# EAGLE design Serial_Adapter (EAGLE 7.5.0)
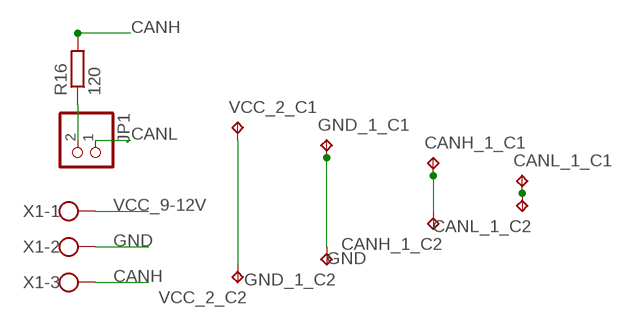
[diagram p0: schematic, sheet 1]

## Parts
CANH_1_C1  TPB2,54  [B2,54]
CANH_1_C2  TPB2,54  [B2,54]
CANL_1_C1  TPB2,54  [B2,54]
CANL_1_C2  TPB2,54  [B2,54]
GND_1_C1  TPB2,54  [B2,54]
GND_1_C2  TPB2,54  [B2,54]
JP1  PINHD-1X2  [1X02]
R16  120  R-EU_R0805  [R0805]
VCC_2_C1  TPB2,54  [B2,54]
VCC_2_C2  TPB2,54  [B2,54]
X1  W237-103  [W237-103]

## Nets
CANH: CANH_1_C1.TP CANH_1_C2.TP R16.2 X1.3
CANL: CANL_1_C1.TP CANL_1_C2.TP JP1.1
GND: GND_1_C1.TP GND_1_C2.TP X1.2
N$1: JP1.2 R16.1
VCC_9-12V: VCC_2_C1.TP VCC_2_C2.TP X1.1

## Library data of the parts
CANH_1_C1 CANH_1_C2 CANL_1_C1 CANL_1_C2 GND_1_C1 GND_1_C2 VCC_2_C1 VCC_2_C2 = testpad:TP: Test pad
JP1 = pinhead:PINHD-1X2: PIN HEADER
R16 = rcl:R-EU_: RESISTOR, European symbol
X1 = con-wago-500:W237-103: WAGO SCREW CLAMP; MPN: 237-103; OC_FARNELL: unknown; OC_NEWARK: 18M7116

## Board
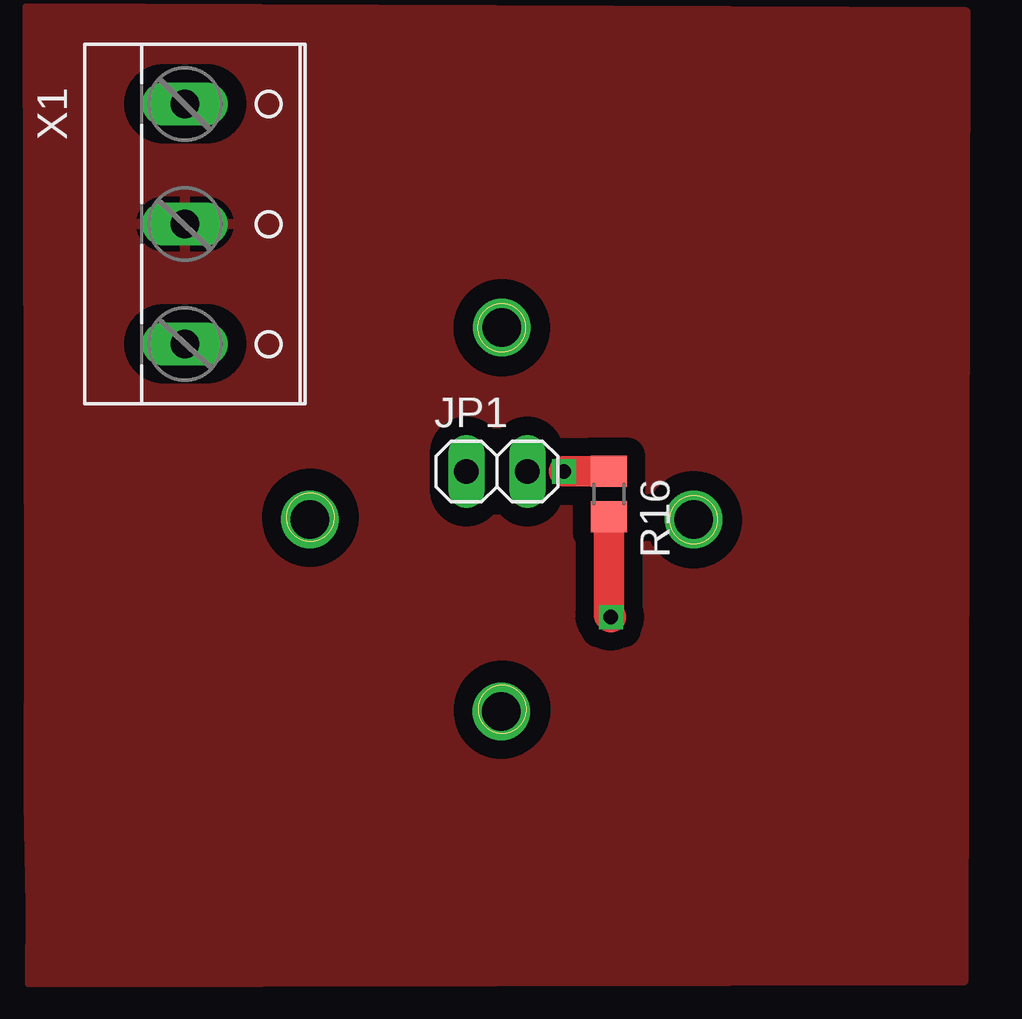
[diagram p1: board, top side]
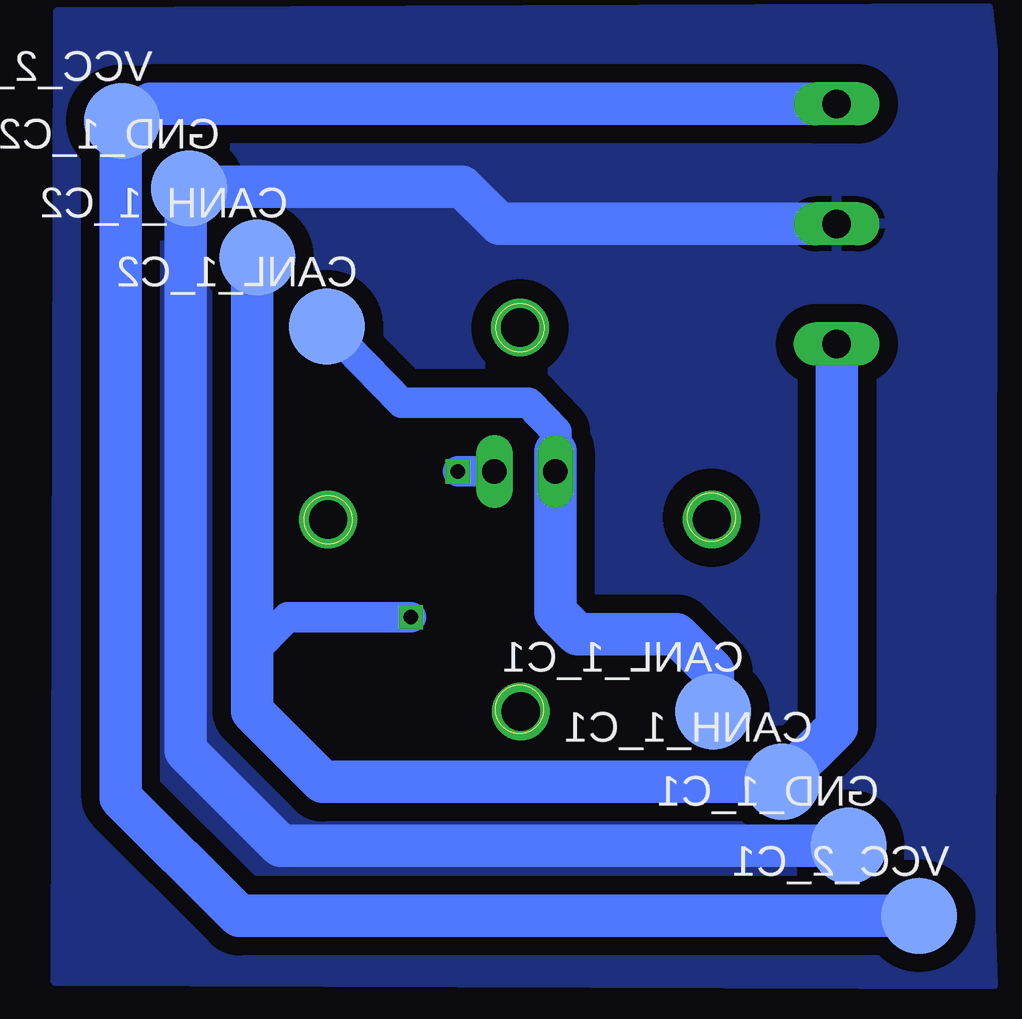
[diagram p2: board, bottom side, seen from below]

Size 17.97 x 17.9 mm. Coordinates in mm from the lower left corner, seen from the top.
Outline: circle at 8.97,16.9 radius 1
Outline: circle at 16.97,8.9 radius 1
Outline: circle at 1,9 radius 1
Outline: circle at 9,1 radius 1
Copper layers (1*16): Top 0.035mm / dielectric 1.5mm / Bottom 0.035mm
Design rules "default": minimum track width 10mil, minimum drill 24mil, track to track 8mil, track to pad 8mil, pad to pad 8mil, via to via 8mil, smd to smd 8mil, copper to edge 40mil, drill to drill 8mil, minimum pad ring 10mil, minimum via ring 8mil, stop-mask expansion 4mil, vias tented up to drill 0mil, thermal gap 10mil

### Footprints (pad centres in the part's own frame; a part is rotated, then mirrored left to right if it is on the bottom)
B2,54 = smd 3.175 x 3.175 bottom: P$1 0,0 | smd 2.54 x 2.54 bottom: TP 0,0
1X02 = drill 1.016 long: 1 -1.27,0; 2 1.27,0
R0805 = smd 1.3 x 1.5: 1 -0.95,0; 2 0.95,0
W237-103 = drill 1.194 long: 1 -5,-1.29; 2 0,-1.29; 3 5,-1.29

### Placement (x,y rotation side)
CANH_1_C1  -1.95,-2.02 0 top
CANH_1_C2  19.92,19.82 0 top
CANL_1_C1  0.92,0.9 0 top
CANL_1_C2  17.03,16.95 0 top
GND_1_C1  -4.72,-4.69 0 top  (outside the outline)
GND_1_C2  22.77,22.69 0 top  (outside the outline)
JP1  8.77,10.91 0 top
R16  13.44,9.97 270 top
VCC_2_C1  -7.66,-7.61 0 top  (outside the outline)
VCC_2_C2  25.56,25.51 0 top  (outside the outline)
X1  -2.94,21.22 270 top  (outside the outline)

### Tracks (layer width: path | path; a pad name or v marks a point on that pad's centre or on a via)
CANH  (via drill 0.6)
  Top 1.27: R16.2 13.44,4.91 v13.52,4.83
  Bottom 0.813: CANH_1_C1.TP -3.22,-2.02
  Bottom 1.27: v13.52,4.83 18.65,4.83 20.15,3.34
  Bottom 1.778: 20.15,19.59 20.15,3.34 20.15,0.92 17.2,-2.02 CANH_1_C1.TP -4.23,0.26 X1.3
  Bottom 2.54: 20.15,19.59 CANH_1_C2.TP
CANL
  Bottom 1.27: 7.5,11.74 7.45,12.56 8.62,13.78 13.9,13.78 CANL_1_C2.TP
  Bottom 1.778: CANL_1_C1.TP 0.92,2.6 2.45,4.12 6.59,4.12 7.5,5.04 JP1.1 7.5,11.74
GND
  Bottom 1.778: GND_1_C1.TP 18.96,-4.69 22.92,-0.73 22.92,22.54 | X1.2 9.84,21.22 11.39,22.77 22.69,22.77 GND_1_C2.TP
  Bottom 2.54: 22.92,22.54 GND_1_C2.TP
  pour Bottom (isolate 0.762): -10.74,28.43 -10.71,18.42 -10.66,-6.72 -10.66,-8.04 -10.74,-10.48 28.33,-10.33 28.23,30.06 -10.53,30.23
  pour Top (isolate 0.762): -10.81,30.21 -10.74,5.42 -10.76,-2.89 -10.69,-7.21 -10.71,-10.38 28.23,-10.3 28.33,30.03
N$1  (via drill 0.6)
  Top 1.27: v11.57,10.91 13.51,10.91 R16.1
  Bottom 1.27: JP1.2 v11.57,10.91
N$23  (via drill 1.6)
  other vias: 16.98,8.9
N$24  (via drill 1.6)
  other vias: 8.97,16.9
N$25  (via drill 1.6)
  other vias: 0.97,8.9
N$28  (via drill 1.6)
  other vias: 8.95,0.9
VCC_9-12V
  Bottom 1.778: VCC_2_C1.TP 20.68,-7.61 25.61,-2.68 25.61,24.98 | 25.61,24.98 25.61,25.46 | X1.1 24.37,26.22 25.61,24.98
  Bottom 2.54: 25.61,25.46 VCC_2_C2.TP